# Altium schematic sheet Sheet1.SchDoc
size A4
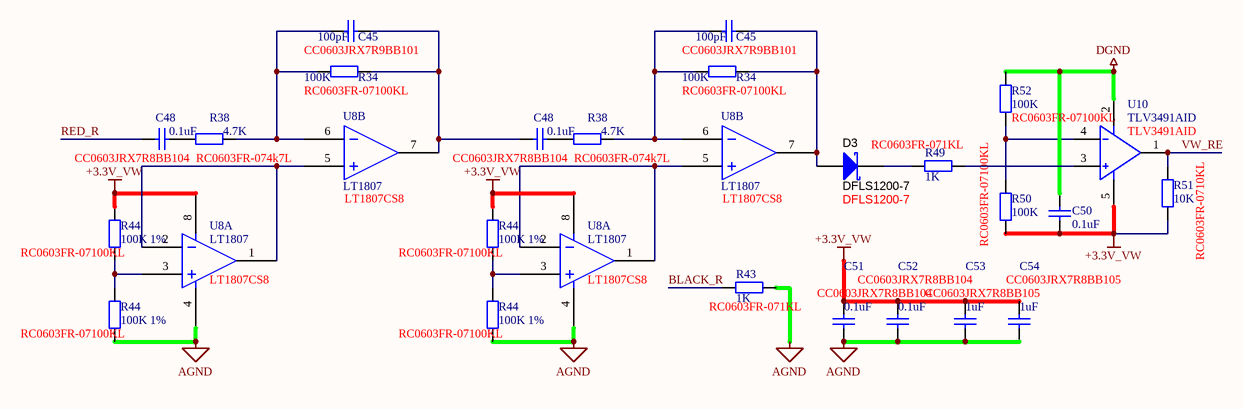
[diagram p0: Sheet1.SchDoc]

## Parts
(Parts that share a designator on the sheet are numbered #1, #2 ... from top to bottom, then left to right.)
C45#1  100pF  Type No.: CC0603JRX7R9BB101  [CC0603]
C45#2  100pF  Type No.: CC0603JRX7R9BB101  [CC0603]
C48#1  0.1uF  Type No.: CC0603JRX7R8BB104  [CC0603]
C48#2  0.1uF  Type No.: CC0603JRX7R8BB104  [CC0603]
C50  0.1uF  [CC0603]
C51  0.1uF  Type No.: CC0603JRX7R8BB104  [CC0603]
C52  0.1uF  Type No.: CC0603JRX7R8BB104  [CC0603]
C53  1uF  Type No.: CC0603JRX7R8BB105  [CC0603]
C54  1uF  Type No.: CC0603JRX7R8BB105  [CC0603]
D3  DFLS1200-7  [powerDI123]
R34#1  100K  Type No.: RC0603FR-07100KL  [CC0603]
R34#2  100K  Type No.: RC0603FR-07100KL  [CC0603]
R38#1  4.7K  Type No.: RC0603FR-074k7L  [CC0603]
R38#2  4.7K  Type No.: RC0603FR-074k7L  [CC0603]
R43  1K  Type No.: RC0603FR-071KL  [CC0603]
R44#1  100K 1%  Type No.: RC0603FR-07100KL  [CC0603]
R44#2  100K 1%  Type No.: RC0603FR-07100KL  [CC0603]
R44#3  100K 1%  Type No.: RC0603FR-07100KL  [CC0603]
R44#4  100K 1%  Type No.: RC0603FR-07100KL  [CC0603]
R49  1K  Type No.: RC0603FR-071KL  [CC0603]
R50  100K  Type No.: RC0603FR-07100KL  [CC0603]
R51  10K  Type No.: RC0603FR-0710KL  [CC0603]
R52  100K  Type No.: RC0603FR-07100KL  [CC0603]
U8#1  LT1807  Type No.: LT1807CS8  [SO-8]  (parts A,B of 2)
U8#2  LT1807  Type No.: LT1807CS8  [SO-8]  (parts A,B of 2)
U10  TLV3491AID  [SOT-23-5]

## Nets
+3.3V_VW: C50.2 C51.2 C52.2 C53.2 C54.2 R44#1.1 R44#2.1 R50.1 R51.1 U8#1.8 U8#2.8 U10.5(+VS)
AGND: C51.1 C52.1 C53.1 C54.1 R43.2 R44#3.2 R44#4.2 U8#1.4 U8#2.4
DGND: C50.1 R52.2 U10.2(-VS)
BLACK_R: R43.1
RED_R: C48#1.2
VW_RE: R51.2 U10.1(OUT)
NetC45#1_1: C45#1.1 C48#2.2 R34#1.1 U8#1.7
NetC45#1_2: C45#1.2 R34#1.2 R38#1.1 U8#1.6
NetC45#2_1: C45#2.1 D3.2(A) R34#2.1 U8#2.7
NetC45#2_2: C45#2.2 R34#2.2 R38#2.1 U8#2.6
NetC48#1_1: C48#1.1 R38#1.2
NetC48#2_1: C48#2.1 R38#2.2
NetD3_1: D3.1(K) R49.2
NetR44#1_2: R44#1.2 R44#3.1 U8#1.3
NetR44#2_2: R44#2.2 R44#4.1 U8#2.3
NetR49_1: R49.1 U10.3(+)
NetR50_2: R50.2 R52.1 U10.4(-)
NetU8#1_1: U8#1.1 U8#1.2 U8#1.5
NetU8#2_1: U8#2.1 U8#2.2 U8#2.5

## Library data of the parts
C45#1 C45#2 C48#1 C48#2 C50-C54 = Cap: Capacitor
  C50: Published: 8-Jun-2000; LatestRevisionDate: 17-Jul-2002; LatestRevisionNote: Re-released for DXP Platform.; PackageReference: RAD-0.3; Publisher: Altium Limited; Value: 0.1uF
D3 = DFLS1200-7: Diode, Schotky, 200V, 1A, PowerDI123; Part No.: DFLS1200-7
R34#1 R34#2 R38#1 R38#2 R43 R44#1-R44#4 R49-R52 = Res2: Resistor
U8#1 U8#2 = LM833N
U10 = TLV3491AID: Type No.: TLV3491AID